# EAGLE design schematic (EAGLE 6.3)
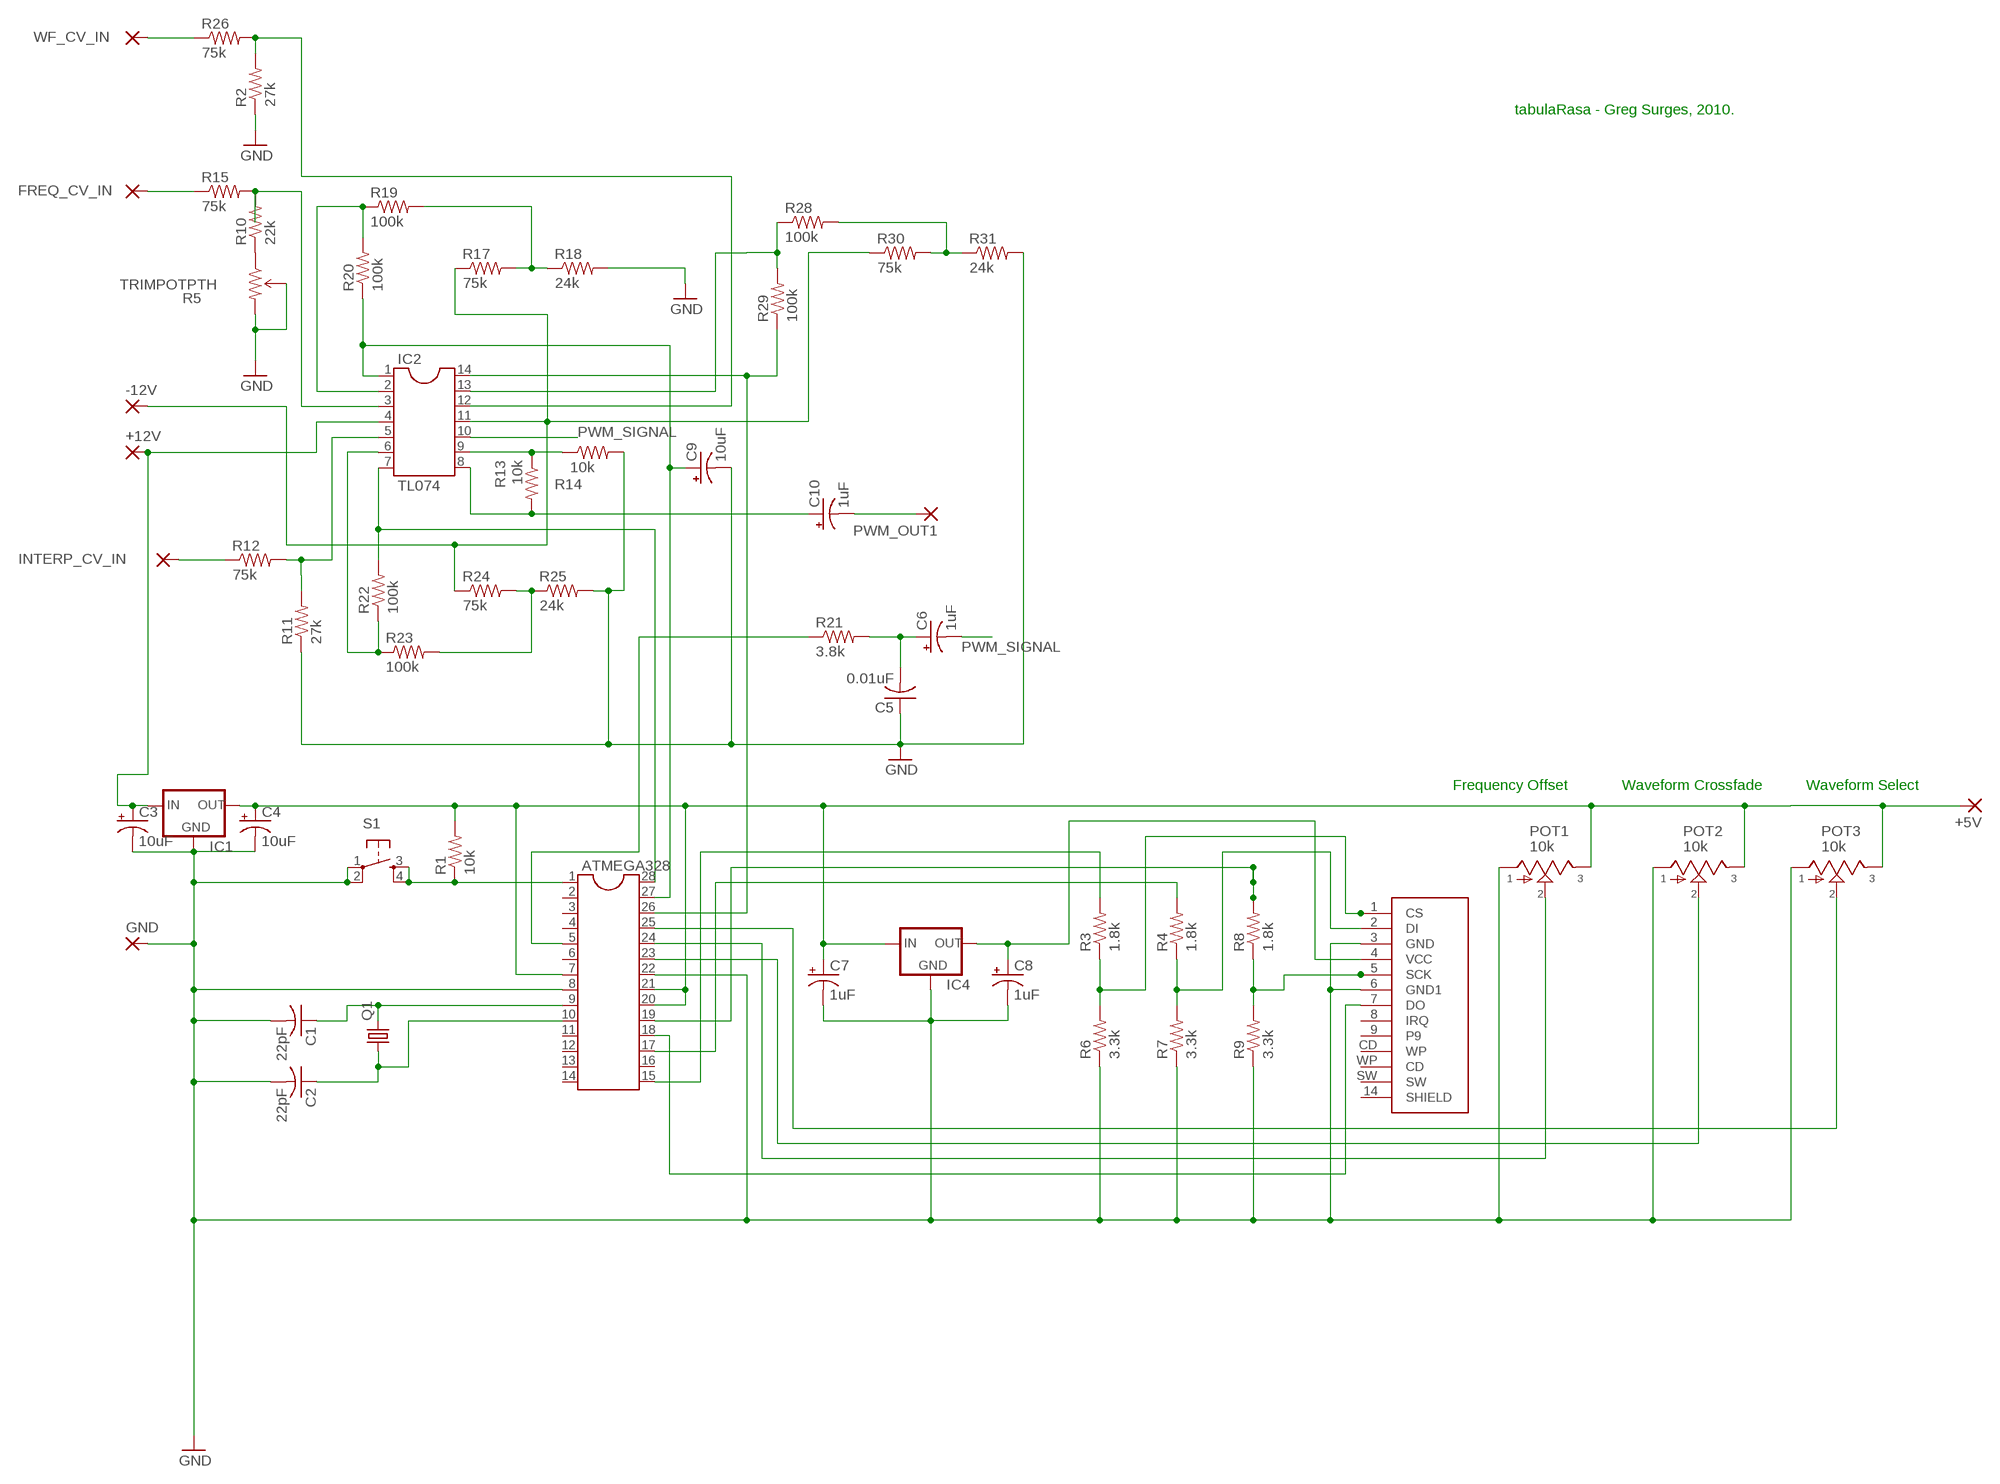
[diagram p0: schematic, sheet 1]

## Parts
+5V  3,81/1,4  [3,81/1,4]
+12V  3,81/1,4  [3,81/1,4]
-12V  3,81/1,4  [3,81/1,4]
ATMEGA328  DIL28-3  [DIL28-3]
C1  22pF  C-US050-025X075  [C050-025X075]
C2  22pF  C-US050-025X075  [C050-025X075]
C3  10uF  CPOL-USE2.5-6  [E2,5-6]
C4  10uF  CPOL-USE2.5-6  [E2,5-6]
C5  0.01uF  C-US050-025X075  [C050-025X075]
C6  1uF  CPOL-USE2.5-6  [E2,5-6]
C7  1uF  CPOL-USE2.5-6  [E2,5-6]
C8  1uF  CPOL-USE2.5-6  [E2,5-6]
C9  10uF  CPOL-USE2.5-6  [E2,5-6]
C10  1uF  CPOL-USE2.5-6  [E2,5-6]
FREQ_CV_IN  3,81/1,4  [3,81/1,4]
GND  3,81/1,4  [3,81/1,4]
IC1  V_REG_78XXSIDE  [78XXL]
IC2  TL074  DIL14  [DIL14]
IC4  MCP1700INLINE  [TO92-INLINE]
INTERP_CV_IN  3,81/1,4  [3,81/1,4]
POT1  10k  POTPCB  [16MM-PCB-MOUNT]
POT2  10k  POTPCB  [16MM-PCB-MOUNT]
POT3  10k  POTPCB  [16MM-PCB-MOUNT]
PWM_OUT1  3,81/1,4  [3,81/1,4]
Q1  CRYSTALHC49US  [HC49US]
R1  10k  R-US_0411/12  [0411/12]
R2  27k  R-US_0411/12  [0411/12]
R3  1.8k  R-US_0411/12  [0411/12]
R4  1.8k  R-US_0411/12  [0411/12]
R5  TRIMPOTPTH  [TRIM_POT_PTH]
R6  3.3k  R-US_0411/12  [0411/12]
R7  3.3k  R-US_0411/12  [0411/12]
R8  1.8k  R-US_0411/12  [0411/12]
R9  3.3k  R-US_0411/12  [0411/12]
R10  22k  R-US_0411/12  [0411/12]
R11  27k  R-US_0411/12  [0411/12]
R12  75k  R-US_0411/12  [0411/12]
R13  10k  R-US_0411/12  [0411/12]
R14  10k  R-US_0411/12  [0411/12]
R15  75k  R-US_0411/12  [0411/12]
R17  75k  R-US_0411/12  [0411/12]
R18  24k  R-US_0411/12  [0411/12]
R19  100k  R-US_0411/12  [0411/12]
R20  100k  R-US_0411/12  [0411/12]
R21  3.8k  R-US_0411/12  [0411/12]
R22  100k  R-US_0411/12  [0411/12]
R23  100k  R-US_0411/12  [0411/12]
R24  75k  R-US_0411/12  [0411/12]
R25  24k  R-US_0411/12  [0411/12]
R26  75k  R-US_0411/12  [0411/12]
R28  100k  R-US_0411/12  [0411/12]
R29  100k  R-US_0411/12  [0411/12]
R30  75k  R-US_0411/12  [0411/12]
R31  24k  R-US_0411/12  [0411/12]
S1  TAC_SWITCHPTH  [TACTILE-PTH]
U$1  SD_CARD_SOCKETSD  [SD-MMC_SOCKET-PP]
WF_CV_IN  3,81/1,4  [3,81/1,4]

## Nets
GND: ATMEGA328.8 ATMEGA328.22 C1.2 C2.2 C3.- C4.- C5.1 C7.- C8.- C9.- GND.1(P) IC1.GND IC4.1(GND) POT1.1 POT2.1 POT3.1 R2.1 R5.2(WIPER) R5.3(CW) R6.1 R7.1 R9.1 R11.1 R14.2 R18.2 R25.2 R31.2 S1.1 S1.2 U$1.3(GND) U$1.6(GND1)
N$1: C8.+ IC4.3(OUT) U$1.4(VCC)
N$2: +5V.1(P) ATMEGA328.7 ATMEGA328.20 ATMEGA328.21 C4.+ C7.+ IC1.OUT IC4.2(IN) POT1.3 POT2.3 POT3.3 R1.2
N$3: R3.1 R6.2 U$1.1(CS)
N$4: ATMEGA328.1 R1.1 S1.3 S1.4
N$5: R4.1 R7.2 U$1.2(DI)
N$6: ATMEGA328.9 C1.1 Q1.2
N$7: ATMEGA328.10 C2.1 Q1.1
N$8: INTERP_CV_IN.1(P) R12.1
N$9: ATMEGA328.18 U$1.7(DO)
N$10: R5.1(CCW) R10.1
N$11: R8.1 R9.2 U$1.5(SCK)
N$12: ATMEGA328.15 R3.2
N$13: ATMEGA328.24 POT1.2
N$14: ATMEGA328.17 R4.2
N$15: ATMEGA328.19 R8.2
N$16: ATMEGA328.23 POT2.2
N$17: ATMEGA328.25 POT3.2
N$18: +12V.1(P) C3.+ IC1.IN IC2.4
N$19: IC2.2 R19.1 R20.2
N$20: ATMEGA328.28 IC2.7 R22.2
N$21: IC2.6 R22.1 R23.1
N$22: FREQ_CV_IN.1(P) R15.1
N$23: IC2.9 R13.1 R14.1
N$24: ATMEGA328.27 C9.+ IC2.1 R20.1
N$25: R17.2 R18.1 R19.2
N$26: R28.2 R30.2 R31.1
N$27: ATMEGA328.5 R21.1
N$28: C5.2 C6.+ R21.2
N$29: R23.2 R24.2 R25.1
N$30: R26.1 WF_CV_IN.1(P)
N$31: IC2.12 R2.2 R26.2
N$32: IC2.13 R28.1 R29.2
N$33: ATMEGA328.26 IC2.14 R29.1
N$34: -12V.1(P) IC2.11 R17.1 R24.1 R30.1
N$35: C10.- PWM_OUT1.1(P)
N$36: IC2.3 R10.2 R15.2
N$37: IC2.5 R11.2 R12.2
OUTPUT: C10.+ IC2.8 R13.2
PWM_SIGNAL: C6.- IC2.10
Unconnected: ATMEGA328.2 ATMEGA328.3 ATMEGA328.4 ATMEGA328.6 ATMEGA328.11 ATMEGA328.12 ATMEGA328.13 ATMEGA328.14 ATMEGA328.16 U$1.8(IRQ) U$1.9 U$1.14(SHIELD) U$1.CD(WP) U$1.SW U$1.WP(CD)

## Notes on the sheet
- tabulaRasa - Greg Surges, 2010.
- Frequency Offset | Waveform Crossfade | Waveform Select

## Library data of the parts
+5V +12V -12V FREQ_CV_IN GND INTERP_CV_IN PWM_OUT1 WF_CV_IN = wirepad:3,81/1,4: THROUGH-HOLE PAD
ATMEGA328 = ic-package:DIL28: Dual In Line
C1 C2 C5 = rcl:C-US: CAPACITOR, American symbol
C3 C4 C6-C10 = rcl:CPOL-US: POLARIZED CAPACITOR, American symbol
IC1 = SparkFun:V_REG_78XX: Voltage Regulator Standard 7805 5V regulator. IGO (Input Ground Output). Spark Fun Electronics SKU : COM-00107
IC2 = ic-package:DIL14: Dual In Line / Socket
IC4 = adafruit:MCP1700: VOLTAGE REGULATOR
POT1-POT3 = gm-pots:POT: Potentiometers the arrow indicates the clockwise motion of th wiper (lug 2) fully counter clockwise there is no resistance between lugs 1 and 2 fully clockwise the resistance between lugs 1 and 2 is the value of the pot
Q1 = SparkFun:CRYSTAL: Crystals Various standard crystals. Proven footprints. Spark Fun Electronics SKU : COM-00534
R1-R4 R6-R15 R17-R26 R28-R31 = rcl:R-US_: RESISTOR, American symbol
R5 = SparkFun-Electromechanical:TRIMPOT: Various small potentiometers for "set-and-forget" applications
S1 = SparkFun:TAC_SWITCH: Momentary Switch Button commonly used for reset or general input. Spark Fun Electronics SKU : COM-00097
U$1 = SparkFun:SD_CARD_SOCKET: SD/MMC Socket Media socket for SD and MMC cards. Push-push type. Schematic element and footprint production proven. Spark Fun Electronics SKU : PRT-00136

## Board
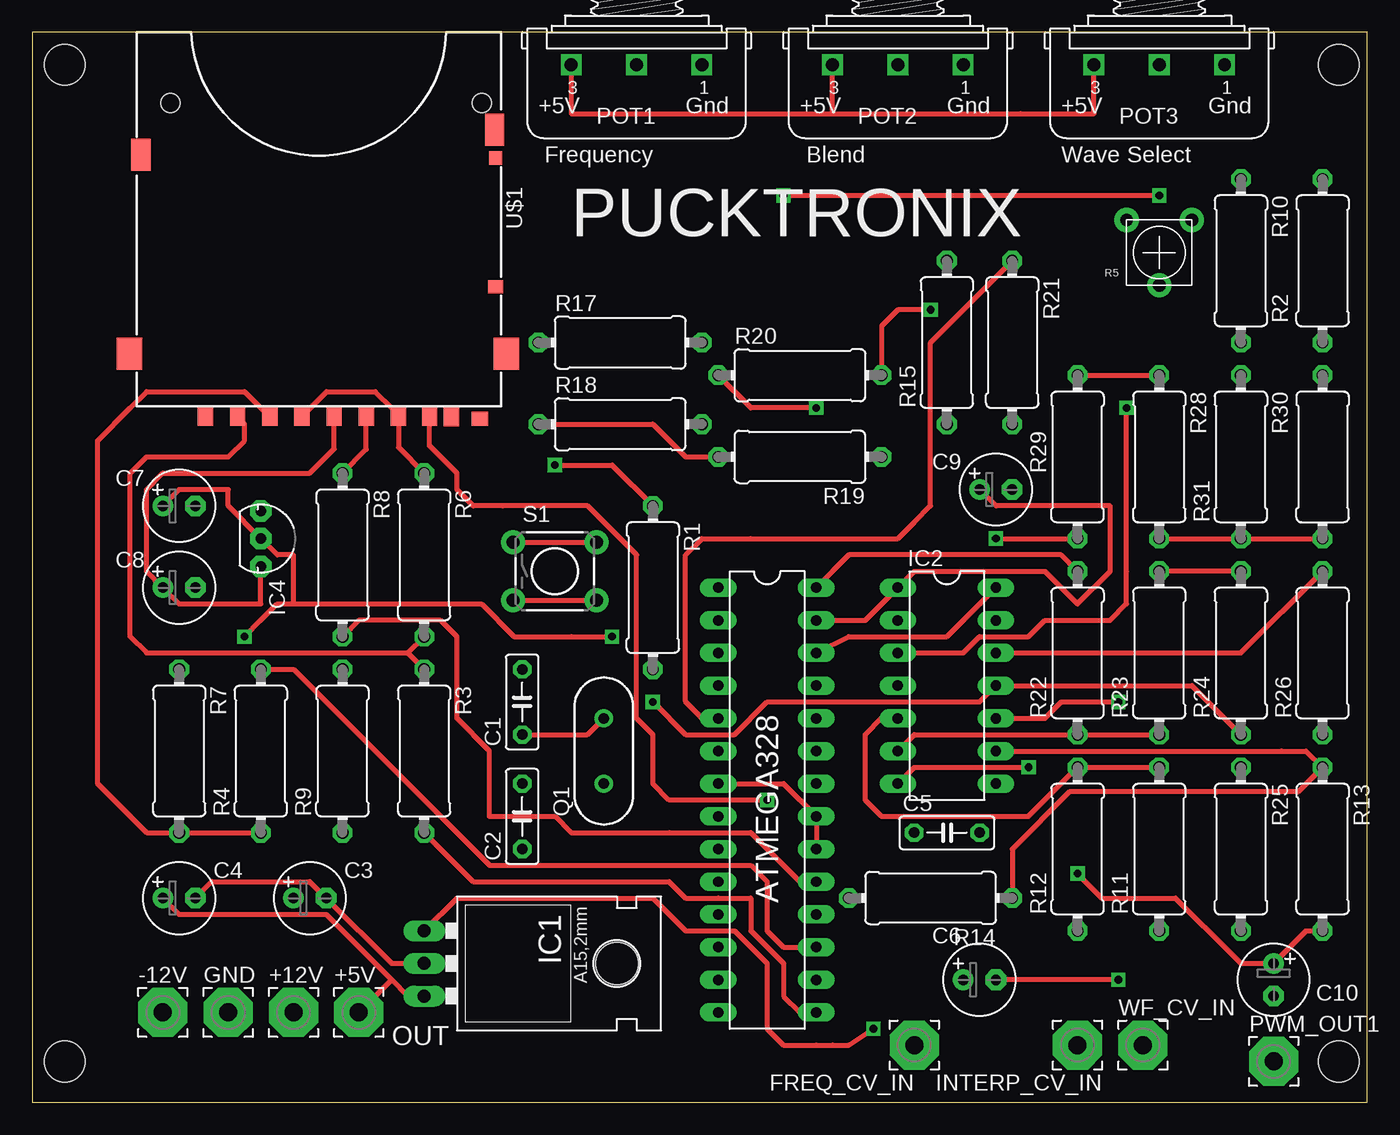
[diagram p1: board, top side]
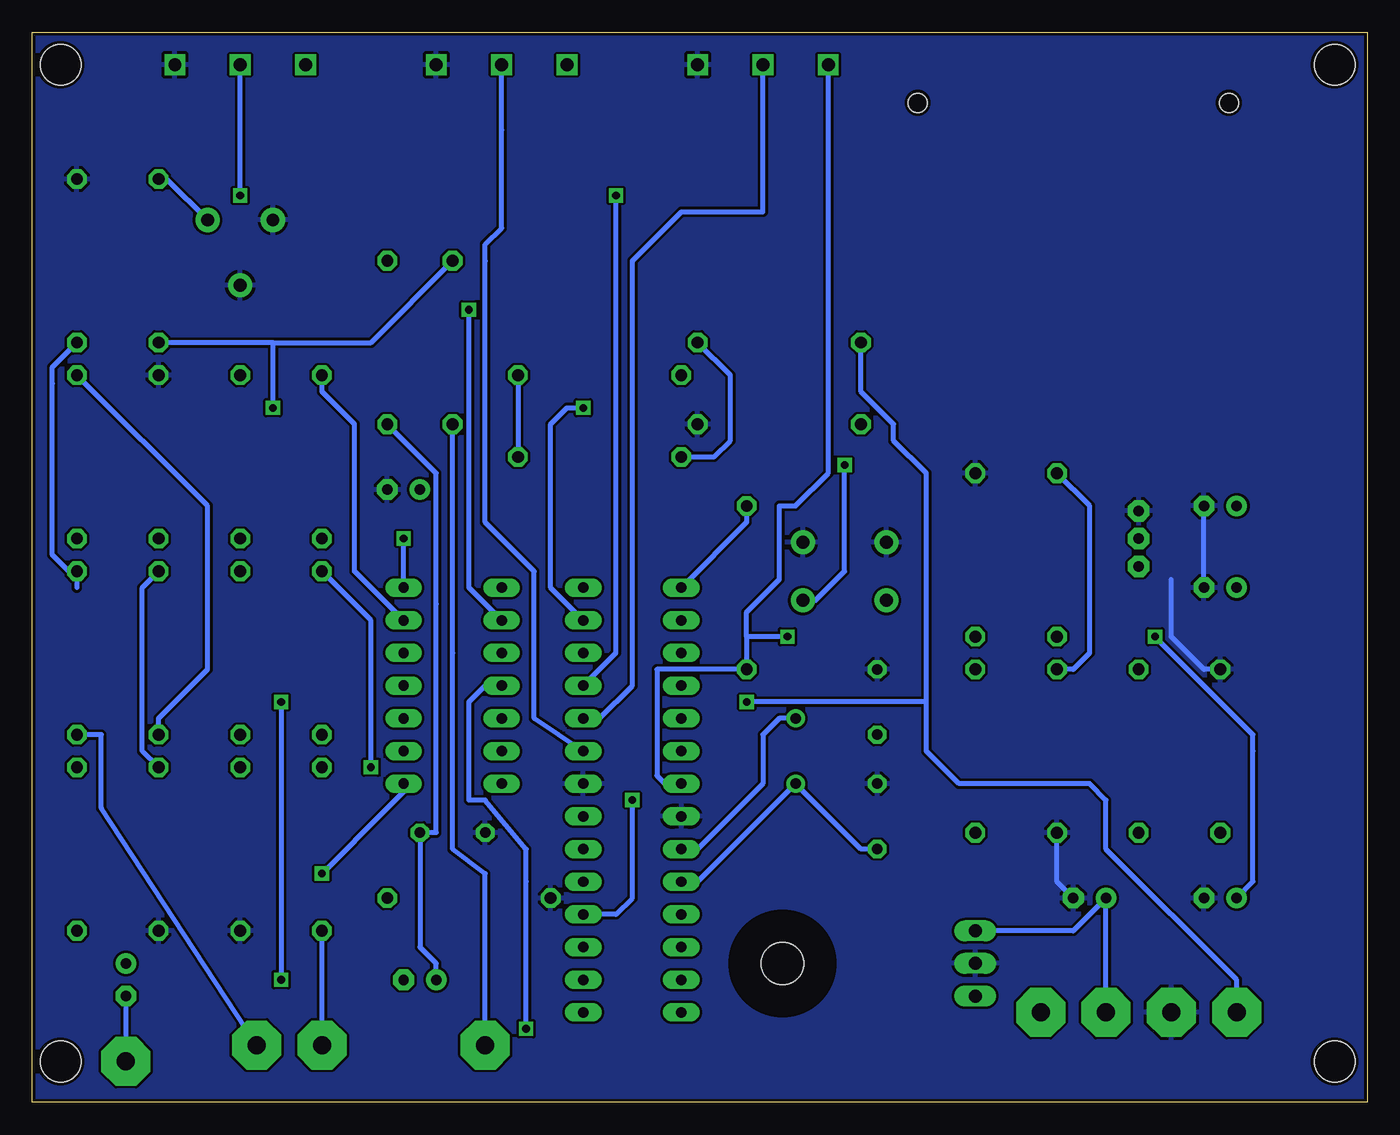
[diagram p2: board, bottom side, seen from below]

Size 103.81 x 83.17 mm. Coordinates in mm from the lower left corner, seen from the top.
Outline: 0,0 103.81,0 103.81,83.17 0,83.17 0,0
Copper layers (1*16): Top 0.035mm / dielectric 1.5mm / Bottom 0.035mm
Design rules "SparkFun": minimum track width 8mil, minimum drill 20mil, track to track 8mil, track to pad 8mil, pad to pad 8mil, via to via 8mil, smd to smd 8mil, copper to edge 10mil, drill to drill 8mil, minimum pad ring 12mil, minimum via ring 10mil, stop-mask expansion 4mil, vias tented up to drill 25mil, thermal gap 10mil
Holes 3.17 mm at 101.6,80.64 101.6,3.17 2.54,3.17 2.54,80.64

### Footprints (pad centres in the part's own frame; a part is rotated, then mirrored left to right if it is on the bottom)
3,81/1,4 = drill 1.397 pad 3.81 octagon: 1 0,0
DIL28-3 = drill 0.813 long: 1 -16.51,-3.81; 2 -13.97,-3.81; 3 -11.43,-3.81; 4 -8.89,-3.81; 5 -6.35,-3.81; 6 -3.81,-3.81; 7 -1.27,-3.81; 8 1.27,-3.81; 9 3.81,-3.81; 10 6.35,-3.81; 11 8.89,-3.81; 12 11.43,-3.81; 13 13.97,-3.81; 14 16.51,-3.81; 15 16.51,3.81; 16 13.97,3.81; 17 11.43,3.81; 18 8.89,3.81; 19 6.35,3.81; 20 3.81,3.81; 21 1.27,3.81; 22 -1.27,3.81; 23 -3.81,3.81; 24 -6.35,3.81; 25 -8.89,3.81; 26 -11.43,3.81; 27 -13.97,3.81; 28 -16.51,3.81
C050-025X075 = drill 0.813 octagon: 1 -2.54,0; 2 2.54,0
E2,5-6 = drill 0.813 pad 1.6: + -1.27,0 | drill 0.813 pad 1.6 octagon: - 1.27,0
78XXL = drill 1.016 long: GND 0,-3.81; IN -2.54,-3.81; OUT 2.54,-3.81 | hole 3.302: 0,11.176
DIL14 = drill 0.813 long: 1 -7.62,-3.81; 2 -5.08,-3.81; 3 -2.54,-3.81; 4 0,-3.81; 5 2.54,-3.81; 6 5.08,-3.81; 7 7.62,-3.81; 8 7.62,3.81; 9 5.08,3.81; 10 2.54,3.81; 11 0,3.81; 12 -2.54,3.81; 13 -5.08,3.81; 14 -7.62,3.81
TO92-INLINE = drill 0.813 pad 1.676 octagon: 1 -2.159,0; 2 0,0; 3 2.159,0
16MM-PCB-MOUNT = drill 1 square: 1 5.08,0; 2 0,0; 3 -5.08,0
HC49US = drill 0.813: 1 -2.54,0; 2 2.54,0
0411/12 = drill 0.914 octagon: 1 -6.35,0; 2 6.35,0
TRIM_POT_PTH = drill 1 pad 1.88: 1 -2.54,-2.54; 2 0,2.54; 3 2.54,-2.54
TACTILE-PTH = drill 1.016 pad 1.88: 1 -3.251,2.261; 2 3.251,2.261; 3 -3.251,-2.261; 4 3.251,-2.261
SD-MMC_SOCKET-PP = smd 1.2 x 1.5: 1 6.88,29.85; 2 4.38,29.85; 3 1.88,29.85; 4 -0.62,29.85; 5 -3.12,29.85; 6 -5.62,29.85; 7 -8.04,29.85; 8 -9.728,29.87; 9 9.38,29.85 | smd 1.5 x 2.5: 12 -13.1,7.6; 13 14.402,9.525 | smd 2 x 2.5: 14 -14,25; 15 15.3,25 | smd 1.15 x 1: CD -13.18,19.8 | smd 1.3 x 1.1: SW -11.938,30.048 | smd 1 x 1.05: WP -13.18,9.8 | hole 1.5: -12.1,5.5; 12.1,5.5

### Placement (x,y rotation side)
+5V  25.4,6.98 0 top
+12V  20.32,6.98 0 top
-12V  10.16,6.98 0 top
ATMEGA328  57.15,23.5 270 top
C1  38.1,31.12 90 top
C2  38.1,22.23 90 top
C3  21.59,15.88 0 top
C4  11.43,15.88 0 top
C5  71.12,20.96 0 top
C6  73.66,9.52 0 top
C7  11.43,46.35 0 top
C8  11.43,40 0 top
C9  74.93,47.62 0 top
C10  96.52,9.52 270 top
FREQ_CV_IN  68.58,4.45 0 top
GND  15.24,6.98 0 top
IC1  34.29,10.79 270 top
IC2  71.12,32.38 270 top
IC4  17.78,43.81 270 top
INTERP_CV_IN  81.28,4.45 180 top
POT1  46.99,80.64 0 top
POT2  67.31,80.64 0 top
POT3  87.63,80.64 0 top
PWM_OUT1  96.52,3.17 0 top
Q1  44.45,27.3 90 top
R1  48.26,40 270 top
R2  100.33,65.41 270 top
R3  30.48,27.3 270 top
R4  17.78,27.3 90 top
R5  87.63,66.04 180 top
R6  30.48,42.54 270 top
R7  11.43,27.3 270 top
R8  24.13,42.54 270 top
R9  24.13,27.3 90 top
R10  93.98,65.41 270 top
R11  87.63,19.69 90 top
R12  81.28,19.69 90 top
R13  100.33,19.69 270 top
R14  69.85,15.88 180 top
R15  71.12,59.05 90 top
R17  45.72,59.05 0 top
R18  45.72,52.7 0 top
R19  59.69,50.16 180 top
R20  59.69,56.52 0 top
R21  76.2,59.05 270 top
R22  81.28,34.92 90 top
R23  87.63,34.92 90 top
R24  93.98,34.92 90 top
R25  93.98,19.69 270 top
R26  100.33,34.92 90 top
R28  87.63,50.16 270 top
R29  81.28,50.16 90 top
R30  100.33,50.16 270 top
R31  93.98,50.16 90 top
S1  40.64,41.27 0 top
U$1  22.86,83.19 180 top
WF_CV_IN  86.36,4.45 0 top

### Tracks (layer width: path | path; a pad name or v marks a point on that pad's centre or on a via)
GND
  Top 0.406: C4.- 13.97,17.14 21.59,17.14 C3.- 27.94,10.79 IC1.GND | R6.1 28.48,50.89 U$1.6 28.48,53.43 27.94,53.97 26.67,55.24 22.89,55.24 U$1.3 | S1.1 S1.2
  Bottom 0.406: C3.- 24.13,17.14 R9.1 | C8.- C7.- | 15.24,40.64 15.24,36.2 12.7,33.66 R7.1
  pour Bottom: 0,83.19 104.14,83.19 104.14,0 0,0
N$1
  Top 0.406: U$1.4 23.48,50.78 21.59,48.89 10.16,48.89 8.89,47.62 8.89,41.27 C8.+ 11.43,38.73 17.78,38.73 IC4.3
N$2  (via drill 0.6)
  Top 0.406: C4.+ 11.43,14.61 22.86,14.61 27.94,9.52 | 27.94,9.52 29.21,8.25 IC1.OUT | 20.32,38.73 19.05,38.73 17.78,37.46 v16.51,36.2 | ATMEGA328.20 ATMEGA328.21 58.42,24.77 54.61,24.77 ATMEGA328.7 | C7.+ 11.43,47.62 15.24,47.62 15.24,46.35 IC4.2 19.05,42.54 20.32,42.54 20.32,38.73 | 27.94,9.52 +5V.1 | 20.32,38.73 34.92,38.73 37.46,36.2 41.91,36.2 v45.09,36.2 | POT1.3 41.91,76.83 62.23,76.83 | 62.23,76.83 POT2.3 62.23,76.83 | 62.23,76.83 76.83,76.83 82.55,76.83 POT3.3
  Bottom 0.406: C4.+ 8.89,17.14 8.89,27.3 8.89,28.57 v16.51,36.2 | POT1.3 41.91,70.48 41.91,48.89 44.45,46.35 45.72,46.35 45.72,40.64 48.26,38.1 48.26,36.2 | 48.26,36.2 R1.2 55.25,33.66 55.25,25.4 54.61,24.77 ATMEGA328.7 | v45.09,36.2 48.26,36.2
N$3
  Top 0.406: 29.21,34.92 8.89,34.92 7.62,36.2 7.62,48.89 8.89,50.16 13.97,50.16 14.08,50.16 15.24,50.16 16.51,51.43 16.51,52.7 15.98,53.23 U$1.1 | 29.21,34.92 R6.2 | 29.21,34.92 R3.1
N$4  (via drill 0.6)
  Top 0.406: S1.3 S1.4 | R1.1 45.09,49.53 v40.64,49.53
  Bottom 0.406: ATMEGA328.1 48.26,45.08 R1.1 | v40.64,49.53 40.64,41.27 42.9,39.01 S1.4
N$5
  Top 0.406: R4.1 R7.2 8.89,20.96 5.08,24.77 5.08,50.16 5.08,51.43 7.62,53.97 8.89,55.24 16.51,55.24 18.42,53.33 U$1.2
N$6
  Top 0.406: Q1.2 43.18,28.57 C1.1
  Bottom 0.406: Q1.2 45.72,29.85 46.99,28.57 46.99,24.77 52.07,19.69 ATMEGA328.9
N$7
  Bottom 0.406: C2.1 39.37,19.69 Q1.1 52.07,17.14 ATMEGA328.10
N$8
  Bottom 0.406: INTERP_CV_IN.1 R12.1
N$9  (via drill 0.6)
  Top 0.406: v57.15,23.5 49.53,23.5 48.26,24.77 48.26,28.57 46.99,29.85 46.99,42.54 43.18,46.35 36.61,46.35 34.29,46.35 33.02,47.62 33.02,48.89 30.9,51.02 U$1.7
  Bottom 0.406: v57.15,23.5 57.15,15.88 58.42,14.61 ATMEGA328.18
N$10
  Bottom 0.406: R10.1 93.34,71.75 R5.1
N$11
  Top 0.406: R8.1 25.98,50.74 U$1.5
  Bottom 0.406: R8.1 21.59,46.35 21.59,34.92 22.86,33.66 R9.2
N$12
  Top 0.406: R3.2 34.29,17.14 49.53,17.14 50.8,15.88 53.34,15.88 55.88,15.88 55.88,13.34 58.42,10.79 58.42,8.25 59.69,6.98 ATMEGA328.15
N$13
  Bottom 0.406: ATMEGA328.24 59.69,29.85 57.15,32.38 57.15,34.92 57.15,52.7 57.15,65.41 53.34,69.22 46.99,69.22 POT1.2
N$14
  Top 0.406: R4.2 20.32,33.66 35.56,18.41 39.37,18.41 55.88,18.41 57.15,17.14 57.15,13.34 58.42,12.07 ATMEGA328.17
N$15
  Top 0.406: R8.2 25.4,37.46 31.75,37.46 33.02,36.2 33.02,29.85 35.56,27.3 35.56,22.23 40.64,22.23 41.91,20.96 49.53,20.96 55.88,20.96 59.69,17.14 ATMEGA328.19
N$16
  Bottom 0.406: ATMEGA328.23 64.77,29.85 64.77,41.27 68.58,45.08 68.58,65.41 68.58,66.67 67.31,67.94 67.31,75.56 POT2.2
N$17  (via drill 0.6)
  Top 0.406: v58.42,70.48 v87.63,70.48
  Bottom 0.406: ATMEGA328.25 58.42,34.92 58.42,57.78 58.42,60.32 v58.42,70.48 | v87.63,70.48 POT3.2
N$18  (via drill 0.6)
  Top 0.406: IC1.IN 33.02,15.88 48.26,15.88 50.8,13.34 54.61,13.34 57.15,10.79 57.15,5.71 58.42,4.45 60.96,4.45 62.23,4.45 63.5,4.45 v65.41,5.71
  Bottom 0.406: +12V.1 C3.+ 22.86,13.34 IC1.IN | v65.41,5.71 65.41,17.14 65.41,19.69 68.58,23.5 69.85,23.5 69.85,31.12 68.58,32.38 IC2.4
N$19  (via drill 0.6)
  Top 0.406: v69.85,61.59 67.31,61.59 66.04,60.32 R20.2
  Bottom 0.406: R20.2 R19.1 | IC2.2 69.85,40 69.85,60.32 v69.85,61.59
N$20  (via drill 0.6)
  Top 0.406: R22.2 80.01,42.54 63.5,42.54 62.23,41.27 ATMEGA328.28 | IC2.7 68.58,26.04 v77.47,26.04
  Bottom 0.406: v77.47,26.04 77.47,37.46 R22.2
N$21
  Top 0.406: R23.1 R22.1 68.58,28.57 IC2.6
N$22
  Bottom 0.406: R15.1 71.12,34.92 71.12,19.69 68.58,17.78 FREQ_CV_IN.1
N$23
  Top 0.406: 99.06,27.3 97.16,27.3 IC2.9 99.06,27.3 | 99.06,27.3 R13.1 | 99.06,27.3 R13.1 | R13.1 98.42,24.13 92.07,24.13 80.64,24.13 76.2,19.69 R14.1
N$24  (via drill 0.6)
  Top 0.406: ATMEGA328.27 64.77,37.46 IC2.1 68.58,41.27 73.66,41.27 78.74,41.27 81.28,38.73 83.82,41.27 83.82,43.81 83.82,46.35 74.93,46.35 C9.+ | v60.96,53.97 55.88,53.97 R20.1
  Bottom 0.406: ATMEGA328.27 63.5,40 63.5,52.7 62.23,53.97 v60.96,53.97
N$25
  Top 0.406: R18.1 48.26,52.7 50.8,50.16 R19.2
  Bottom 0.406: R17.2 49.53,56.52 49.53,55.24 49.53,51.43 50.8,50.16 52.07,50.16 R19.2
N$26
  Top 0.406: R28.2 R31.1 R30.2
N$27
  Top 0.406: R21.1 69.85,59.05 69.85,46.35 68.58,45.08 67.31,43.81 55.88,43.81 52.07,43.81 50.8,42.54 50.8,31.12 52.07,29.85 ATMEGA328.5
N$28
  Bottom 0.406: R21.2 72.39,48.89 72.39,38.73 72.39,20.96 C5.2 73.66,12.07 72.39,10.79 C6.+
N$29
  Top 0.406: R24.2 R23.2
  Bottom 0.406: R25.1 95.25,27.3 95.25,40 R24.2
N$30
  Bottom 0.406: WF_CV_IN.1 98.42,22.86 98.42,28.57 R26.1
N$31
  Top 0.406: R26.2 93.98,34.92 IC2.12
  Bottom 0.406: 100.33,40 R26.2 100.96,41.27 102.23,42.54 102.23,55.88 102.23,57.15 R2.2
N$32
  Top 0.406: R29.2 R28.1
  Bottom 0.406: IC2.13 77.47,40 78.74,41.27 78.74,52.7 81.28,55.24 R29.2
N$33  (via drill 0.6)
  Top 0.406: IC2.14 71.12,36.2 63.5,36.2 ATMEGA328.26 | v74.93,43.81 R29.1
  Bottom 0.406: IC2.14 v74.93,43.81
N$34  (via drill 0.6)
  Top 0.406: R24.1 90.17,32.38 IC2.11 73.66,31.12 57.15,31.12 54.61,28.57 50.8,28.57 v48.26,31.12
  Bottom 0.406: R30.1 90.17,46.35 90.17,33.66 93.98,29.85 R24.1 | R17.1 39.37,55.24 36.83,52.7 36.83,51.43 34.29,48.89 34.29,31.12 | 34.29,31.12 34.29,27.3 31.75,24.77 21.59,24.77 20.32,23.5 20.32,19.69 10.16,9.52 -12V.1 | 34.29,31.12 v48.26,31.12
N$35
  Bottom 0.406: C10.- PWM_OUT1.1
N$36  (via drill 0.6)
  Top 0.406: IC2.3 72.39,34.92 73.66,36.2 77.47,36.2 78.74,37.46 80.01,37.46 83.82,37.46 85.09,38.73 85.09,41.27 v85.09,53.97
  Bottom 0.406: v85.09,53.97 85.09,59.05 | 85.09,59.05 R10.2 | R15.2 77.47,59.05 85.09,59.05
N$37
  Top 0.406: IC2.5 66.04,29.85 64.77,28.57 64.77,23.5 66.04,22.23 77.47,22.23 R12.2 R11.2
OUTPUT  (via drill 0.6)
  Top 0.406: v81.28,17.78 83.18,15.88 88.9,15.88 93.34,11.43 93.98,10.79 C10.+ 99.06,13.34 R13.2
  Bottom 0.406: IC2.8 74.93,24.13 76.2,22.86 v81.28,17.78
PWM_SIGNAL  (via drill 0.6)
  Top 0.406: IC2.10 78.74,29.85 80.01,31.12 v84.45,31.12 | v84.45,9.52 C6.-
  Bottom 0.406: v84.45,31.12 v84.45,9.52

### Text on the board
tNames: +5V | Gnd | +5V | Gnd | +5V | Gnd | Frequency | Blend | Wave Select | PUCKTRONIX | OUT
tValues: tabulaRasa 1.1 - http://www.gregsurges.com/